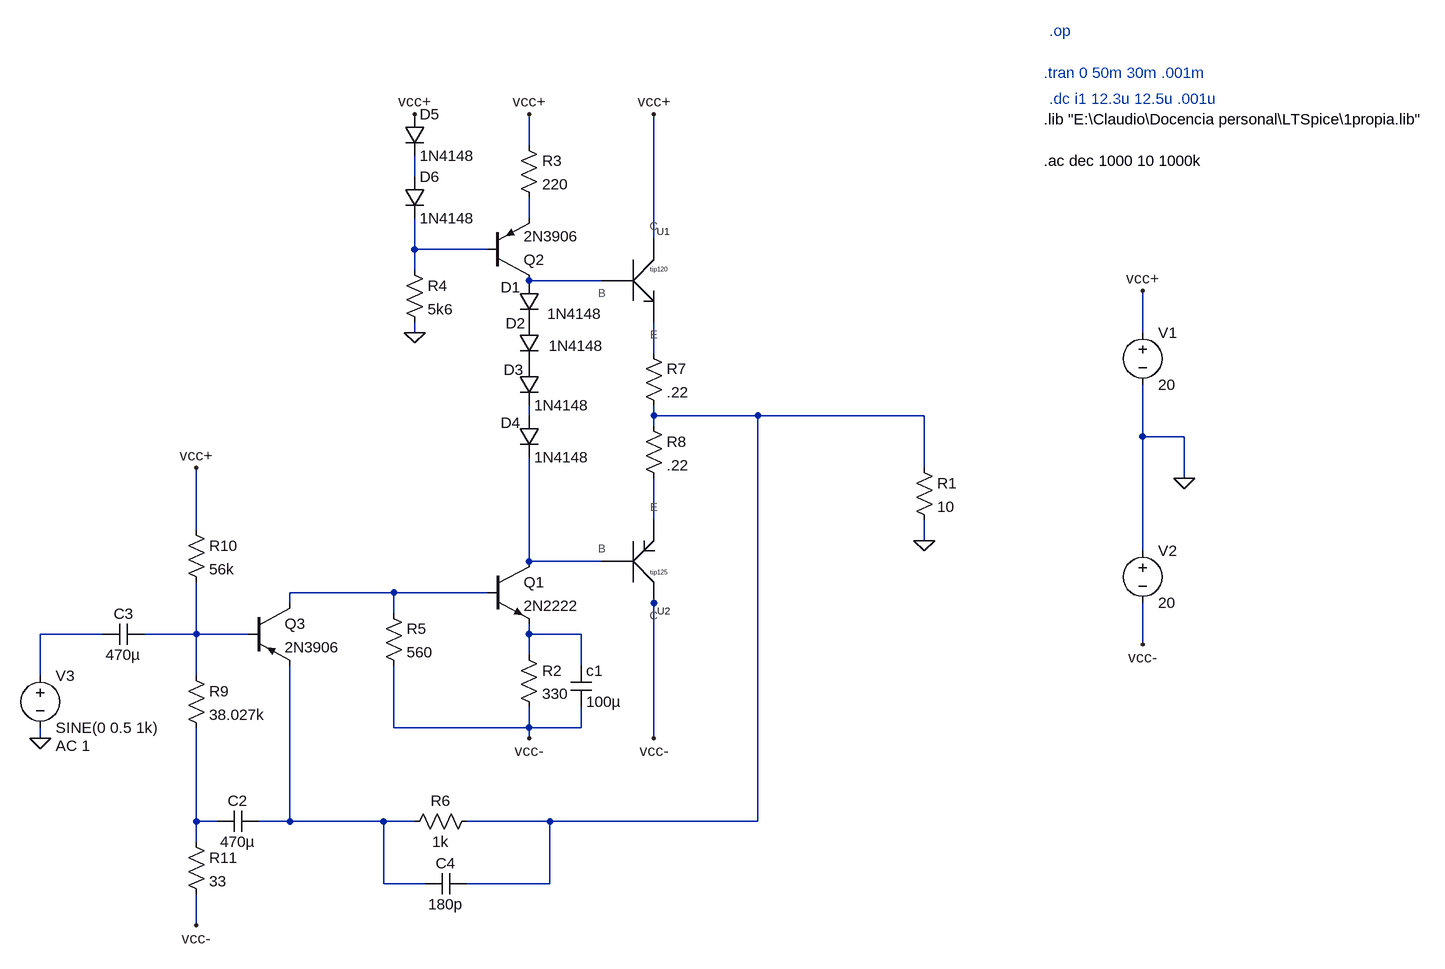
[diagram p0: schematic clase b darlington 3.asc]
clase b darlington 3.asc, the LTspice schematic file:
Version 4
SHEET 1 1988 1196
WIRE 544 -96 544 -144
WIRE 368 -48 368 -80
WIRE 544 16 544 -16
WIRE 736 48 736 -144
WIRE 368 64 368 16
WIRE 480 64 368 64
WIRE 368 96 368 64
WIRE 656 112 544 112
WIRE 368 192 368 176
WIRE 1488 192 1488 128
WIRE 736 224 736 176
WIRE 544 320 544 304
WIRE 736 320 736 304
WIRE 896 320 736 320
WIRE 1152 320 896 320
WIRE 736 336 736 320
WIRE 1488 352 1488 272
WIRE 1552 352 1488 352
WIRE 1152 400 1152 320
WIRE 1552 416 1552 352
WIRE 736 480 736 416
WIRE 32 496 32 400
WIRE 1152 512 1152 480
WIRE 1488 528 1488 352
WIRE 544 544 544 384
WIRE 656 544 544 544
WIRE 336 592 176 592
WIRE 480 592 336 592
WIRE 176 608 176 592
WIRE 736 608 736 592
WIRE 336 624 336 592
WIRE -112 656 -208 656
WIRE 32 656 32 576
WIRE 32 656 -48 656
WIRE 112 656 32 656
WIRE 544 656 544 640
WIRE 624 656 544 656
WIRE 1488 672 1488 608
WIRE 544 688 544 656
WIRE 624 704 624 656
WIRE -208 720 -208 656
WIRE 32 720 32 656
WIRE 336 800 336 704
WIRE 544 800 544 768
WIRE 544 800 336 800
WIRE 624 800 624 768
WIRE 624 800 544 800
WIRE -208 816 -208 800
WIRE 544 816 544 800
WIRE 736 816 736 608
WIRE 32 944 32 800
WIRE 64 944 32 944
WIRE 176 944 176 704
WIRE 176 944 128 944
WIRE 320 944 176 944
WIRE 368 944 320 944
WIRE 576 944 448 944
WIRE 896 944 896 320
WIRE 896 944 576 944
WIRE 32 976 32 944
WIRE 320 1040 320 944
WIRE 384 1040 320 1040
WIRE 576 1040 576 944
WIRE 576 1040 448 1040
WIRE 32 1104 32 1056
FLAG 1152 512 0
FLAG 1552 416 0
FLAG 1488 128 vcc+
FLAG 736 -144 vcc+
FLAG 1488 672 vcc-
FLAG 736 816 vcc-
FLAG 544 -144 vcc+
FLAG 544 816 vcc-
FLAG 368 -144 vcc+
FLAG 368 192 0
FLAG 32 400 vcc+
FLAG 32 1104 vcc-
FLAG -208 816 0
DATAFLAG 944 320 ""
DATAFLAG 384 592 ""
DATAFLAG 624 112 ""
DATAFLAG 576 544 ""
SYMBOL Darlington\ npn 704 112 R0
SYMATTR Value tip120
SYMATTR InstName U1
SYMBOL Darlington\ pnp 704 544 M180
SYMATTR Value tip125
SYMATTR InstName U2
SYMBOL res 1136 384 R0
SYMATTR InstName R1
SYMATTR Value 10
SYMBOL voltage 1488 176 R0
WINDOW 123 0 0 Left 0
WINDOW 39 0 0 Left 0
SYMATTR InstName V1
SYMATTR Value 20
SYMBOL voltage 1488 512 R0
WINDOW 123 0 0 Left 0
WINDOW 39 0 0 Left 0
SYMATTR InstName V2
SYMATTR Value 20
SYMBOL diode 528 112 R0
WINDOW 0 -28 10 Left 2
WINDOW 3 44 51 Left 2
SYMATTR InstName D1
SYMATTR Value 1N4148
SYMBOL diode 528 176 R0
WINDOW 0 -20 2 Left 2
WINDOW 3 46 36 Left 2
SYMATTR InstName D2
SYMATTR Value 1N4148
SYMBOL diode 528 240 R0
WINDOW 0 -23 9 Left 2
SYMATTR InstName D3
SYMATTR Value 1N4148
SYMBOL diode 528 320 R0
WINDOW 0 -28 11 Left 2
SYMATTR InstName D4
SYMATTR Value 1N4148
SYMBOL res 720 208 R0
SYMATTR InstName R7
SYMATTR Value .22
SYMBOL res 720 320 R0
SYMATTR InstName R8
SYMATTR Value .22
SYMBOL npn 480 544 R0
SYMATTR InstName Q1
SYMATTR Value 2N2222
SYMBOL res 528 672 R0
SYMATTR InstName R2
SYMATTR Value 330
SYMBOL cap 608 704 R0
SYMATTR InstName c1
SYMATTR Value 100µ
SYMBOL pnp 480 112 M180
SYMATTR InstName Q2
SYMATTR Value 2N3906
SYMBOL res 528 -112 R0
SYMATTR InstName R3
SYMATTR Value 220
SYMBOL diode 352 -144 R0
SYMATTR InstName D5
SYMATTR Value 1N4148
SYMBOL diode 352 -48 R0
SYMATTR InstName D6
SYMATTR Value 1N4148
SYMBOL res 352 80 R0
SYMATTR InstName R4
SYMATTR Value 5k6
SYMBOL res 320 608 R0
SYMATTR InstName R5
SYMATTR Value 560
SYMBOL pnp 112 608 R0
SYMATTR InstName Q3
SYMATTR Value 2N3906
SYMBOL res 464 928 R90
WINDOW 0 0 56 VBottom 2
WINDOW 3 32 56 VTop 2
SYMATTR InstName R6
SYMATTR Value 1k
SYMBOL res 16 704 R0
SYMATTR InstName R9
SYMATTR Value 38.027k
SYMBOL res 16 480 R0
SYMATTR InstName R10
SYMATTR Value 56k
SYMBOL res 16 960 R0
SYMATTR InstName R11
SYMATTR Value 33
SYMBOL cap 128 928 R90
WINDOW 0 0 32 VBottom 2
WINDOW 3 32 32 VTop 2
SYMATTR InstName C2
SYMATTR Value 470µ
SYMBOL cap -48 640 R90
WINDOW 0 0 32 VBottom 2
WINDOW 3 32 32 VTop 2
SYMATTR InstName C3
SYMATTR Value 470µ
SYMBOL voltage -208 704 R0
WINDOW 123 24 124 Left 2
WINDOW 39 0 0 Left 0
SYMATTR Value2 AC 1
SYMATTR InstName V3
SYMATTR Value SINE(0 0.5 1k)
SYMBOL cap 448 1024 R90
WINDOW 0 0 32 VBottom 2
WINDOW 3 32 32 VTop 2
SYMATTR InstName C4
SYMATTR Value 180p
TEXT 1336 -136 Left 2 !.lib "E:\\Claudio\\Docencia personal\\LTSpice\\1propia.lib"
TEXT 1344 -272 Left 2 ;.op
TEXT 1344 -168 Left 2 ;.dc i1 12.3u 12.5u .001u
TEXT 1336 -208 Left 2 ;.tran 0 50m 30m .001m
TEXT 1336 -72 Left 2 !.ac dec 1000 10 1000k

The netlist it stands for:
* clase b darlington 3.asc
XU1 vcc+ N004 N005 tip120  ; pins C B E
XU2 vcc- N009 N008 tip125  ; pins C B E
R1 N007 0 10
V1 vcc+ 0 20
V2 0 vcc- 20
D1 N004 P001 1N4148
D2 P001 P002 1N4148
D3 P002 N006 1N4148
D4 N006 N009 1N4148
R7 N005 N007 .22
R8 N007 N008 .22
Q1 N009 N010 N013 0 2N2222
R2 N013 vcc- 330
c1 N013 vcc- 100µ
Q2 N004 N003 N002 0 2N3906
R3 vcc+ N002 220
D5 vcc+ N001 1N4148
D6 N001 N003 1N4148
R4 N003 0 5k6
R5 N010 vcc- 560
Q3 N010 N012 N015 0 2N3906
R6 N007 N015 1k
R9 N012 N014 38.027k
R10 vcc+ N012 56k
R11 N014 vcc- 33
C2 N015 N014 470µ
C3 N012 N011 470µ
V3 N011 0 SINE(0 0.5 1k) AC 1
C4 N007 N015 180p
.model D D
.lib standard.dio
.model NPN NPN
.model PNP PNP
.lib standard.bjt
.lib "E:\Claudio\Docencia personal\LTSpice\1propia.lib"
* .op
* .dc i1 12.3u 12.5u .001u
* .tran 0 50m 30m .001m
.ac dec 1000 10 1000k
.backanno
.end